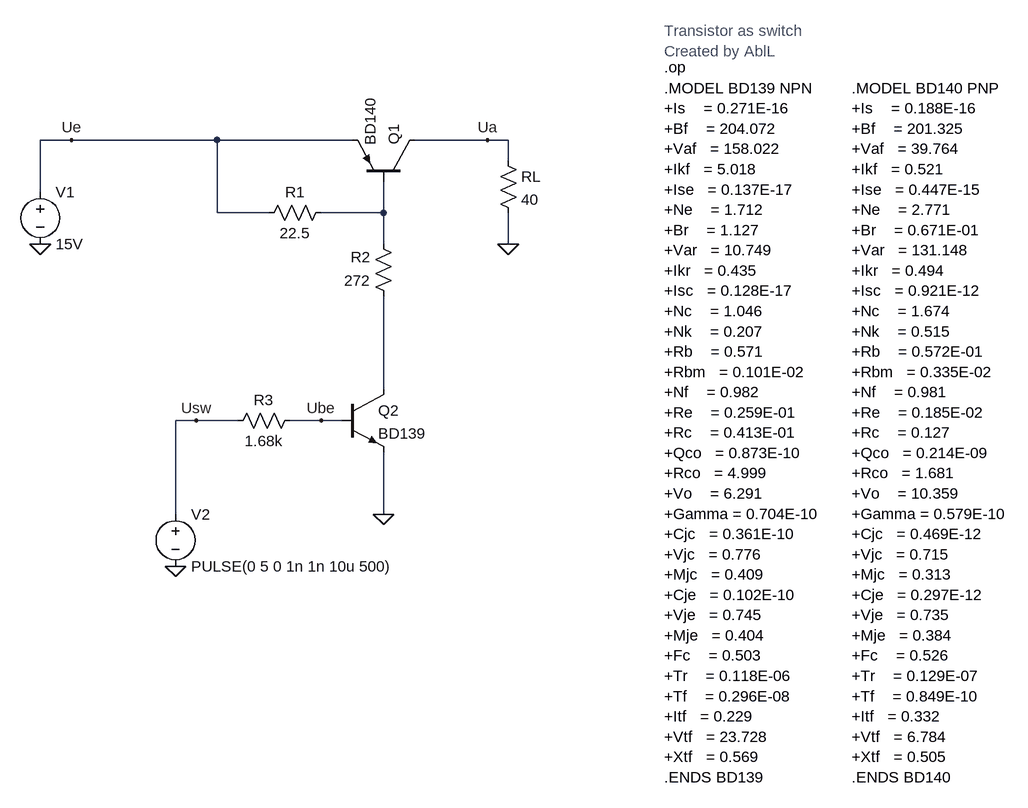
[diagram p0: schematic Transistor_als_Schalter_BUCK.asc]
Transistor_als_Schalter_BUCK.asc, the LTspice schematic file:
Version 4
SHEET 1 1268 1720
WIRE -192 -32 -240 -32
WIRE 32 -32 -192 -32
WIRE 240 -32 32 -32
WIRE 448 -32 336 -32
WIRE 480 -32 448 -32
WIRE 480 0 480 -32
WIRE -240 48 -240 -32
WIRE 32 80 32 -32
WIRE 112 80 32 80
WIRE 288 80 288 32
WIRE 288 80 192 80
WIRE 288 128 288 80
WIRE 480 128 480 80
WIRE 288 352 288 208
WIRE 0 400 -32 400
WIRE 64 400 0 400
WIRE 192 400 144 400
WIRE 224 400 192 400
WIRE -32 544 -32 400
WIRE 288 544 288 448
FLAG -240 128 0
FLAG -32 624 0
FLAG 480 128 0
FLAG 288 544 0
FLAG 448 -32 Ua
FLAG -192 -32 Ue
FLAG 0 400 Usw
FLAG 192 400 Ube
SYMBOL voltage -240 32 R0
SYMATTR InstName V1
SYMATTR Value 15V
SYMBOL voltage -32 528 R0
WINDOW 123 0 0 Left 0
WINDOW 39 0 0 Left 0
SYMATTR InstName V2
SYMATTR Value PULSE(0 5 0 1n 1n 10u 500)
SYMBOL res 208 64 R90
WINDOW 0 0 56 VBottom 2
WINDOW 3 32 56 VTop 2
SYMATTR InstName R1
SYMATTR Value 22.5
SYMBOL res 304 224 R180
WINDOW 0 36 76 Left 2
WINDOW 3 36 40 Left 2
SYMATTR InstName R2
SYMATTR Value 272
SYMBOL res 48 416 R270
WINDOW 0 32 56 VTop 2
WINDOW 3 0 56 VBottom 2
SYMATTR InstName R3
SYMATTR Value 1.68k
SYMBOL pnp 336 32 M270
SYMATTR InstName Q1
SYMATTR Value BD140
SYMBOL npn 224 352 R0
SYMATTR InstName Q2
SYMATTR Value BD139
SYMBOL res 464 -16 R0
SYMATTR InstName RL
SYMATTR Value 40
TEXT 720 -200 Left 2 ;Transistor as switch\nCreated by AblL
TEXT 720 -144 Left 2 !.op
TEXT 720 -112 Left 2 !.MODEL BD139 NPN\n+Is    = 0.271E-16\n+Bf    = 204.072\n+Vaf   = 158.022\n+Ikf   = 5.018\n+Ise   = 0.137E-17\n+Ne    = 1.712\n+Br    = 1.127\n+Var   = 10.749\n+Ikr   = 0.435\n+Isc   = 0.128E-17\n+Nc    = 1.046\n+Nk    = 0.207\n+Rb    = 0.571\n+Rbm   = 0.101E-02\n+Nf    = 0.982\n+Re    = 0.259E-01\n+Rc    = 0.413E-01\n+Qco   = 0.873E-10\n+Rco   = 4.999\n+Vo    = 6.291\n+Gamma = 0.704E-10\n+Cjc   = 0.361E-10\n+Vjc   = 0.776\n+Mjc   = 0.409\n+Cje   = 0.102E-10\n+Vje   = 0.745\n+Mje   = 0.404\n+Fc    = 0.503\n+Tr    = 0.118E-06\n+Tf    = 0.296E-08\n+Itf   = 0.229\n+Vtf   = 23.728\n+Xtf   = 0.569\n.ENDS BD139
TEXT 1008 -112 Left 2 !.MODEL BD140 PNP\n+Is    = 0.188E-16\n+Bf    = 201.325\n+Vaf   = 39.764\n+Ikf   = 0.521\n+Ise   = 0.447E-15\n+Ne    = 2.771\n+Br    = 0.671E-01\n+Var   = 131.148\n+Ikr   = 0.494\n+Isc   = 0.921E-12\n+Nc    = 1.674\n+Nk    = 0.515\n+Rb    = 0.572E-01\n+Rbm   = 0.335E-02\n+Nf    = 0.981\n+Re    = 0.185E-02\n+Rc    = 0.127\n+Qco   = 0.214E-09\n+Rco   = 1.681\n+Vo    = 10.359\n+Gamma = 0.579E-10\n+Cjc   = 0.469E-12\n+Vjc   = 0.715\n+Mjc   = 0.313\n+Cje   = 0.297E-12\n+Vje   = 0.735\n+Mje   = 0.384\n+Fc    = 0.526\n+Tr    = 0.129E-07\n+Tf    = 0.849E-10\n+Itf   = 0.332\n+Vtf   = 6.784\n+Xtf   = 0.505\n.ENDS BD140

The netlist it stands for:
* Transistor_als_Schalter_BUCK.asc
V1 Ue 0 15V
V2 Usw 0 PULSE(0 5 0 1n 1n 10u 500)
R1 N001 Ue 22.5
R2 N002 N001 272
R3 Usw Ube 1.68k
Q1 Ua N001 Ue 0 BD140
Q2 N002 Ube 0 0 BD139
RL Ua 0 40
.model NPN NPN
.model PNP PNP
.lib standard.bjt
* Transistor as switch
* Created by AblL
.op
.MODEL BD139 NPN
+Is    = 0.271E-16
+Bf    = 204.072
+Vaf   = 158.022
+Ikf   = 5.018
+Ise   = 0.137E-17
+Ne    = 1.712
+Br    = 1.127
+Var   = 10.749
+Ikr   = 0.435
+Isc   = 0.128E-17
+Nc    = 1.046
+Nk    = 0.207
+Rb    = 0.571
+Rbm   = 0.101E-02
+Nf    = 0.982
+Re    = 0.259E-01
+Rc    = 0.413E-01
+Qco   = 0.873E-10
+Rco   = 4.999
+Vo    = 6.291
+Gamma = 0.704E-10
+Cjc   = 0.361E-10
+Vjc   = 0.776
+Mjc   = 0.409
+Cje   = 0.102E-10
+Vje   = 0.745
+Mje   = 0.404
+Fc    = 0.503
+Tr    = 0.118E-06
+Tf    = 0.296E-08
+Itf   = 0.229
+Vtf   = 23.728
+Xtf   = 0.569
.ENDS BD139
.MODEL BD140 PNP
+Is    = 0.188E-16
+Bf    = 201.325
+Vaf   = 39.764
+Ikf   = 0.521
+Ise   = 0.447E-15
+Ne    = 2.771
+Br    = 0.671E-01
+Var   = 131.148
+Ikr   = 0.494
+Isc   = 0.921E-12
+Nc    = 1.674
+Nk    = 0.515
+Rb    = 0.572E-01
+Rbm   = 0.335E-02
+Nf    = 0.981
+Re    = 0.185E-02
+Rc    = 0.127
+Qco   = 0.214E-09
+Rco   = 1.681
+Vo    = 10.359
+Gamma = 0.579E-10
+Cjc   = 0.469E-12
+Vjc   = 0.715
+Mjc   = 0.313
+Cje   = 0.297E-12
+Vje   = 0.735
+Mje   = 0.384
+Fc    = 0.526
+Tr    = 0.129E-07
+Tf    = 0.849E-10
+Itf   = 0.332
+Vtf   = 6.784
+Xtf   = 0.505
.ENDS BD140
.backanno
.end